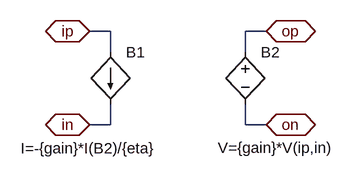
[diagram p0: schematic dcdc.asc]
dcdc.asc, the LTspice schematic file:
Version 4.1
SHEET 1 880 680
WIRE 80 112 48 112
WIRE 320 112 288 112
WIRE 80 144 80 112
WIRE 288 144 288 112
WIRE 80 256 80 224
WIRE 80 256 48 256
WIRE 288 256 288 224
WIRE 320 256 288 256
FLAG 48 112 ip
IOPIN 48 112 BiDir
FLAG 48 256 in
IOPIN 48 256 BiDir
FLAG 320 112 op
IOPIN 320 112 BiDir
FLAG 320 256 on
IOPIN 320 256 BiDir
SYMBOL bi 80 144 R0
WINDOW 3 -138 148 Left 2
SYMATTR Value I=-{gain}*I(B2)/{eta}
SYMATTR InstName B1
SYMBOL bv 288 128 R0
WINDOW 3 -42 163 Left 2
SYMATTR Value V={gain}*V(ip,in)
SYMATTR InstName B2

The netlist it stands for:
* dcdc.asc
B1 ip in I=-{gain}*I(B2)/{eta}
B2 op on V={gain}*V(ip,in)
.backanno
.end